# EAGLE design SingleMotorBoard (EAGLE 8.5.0)
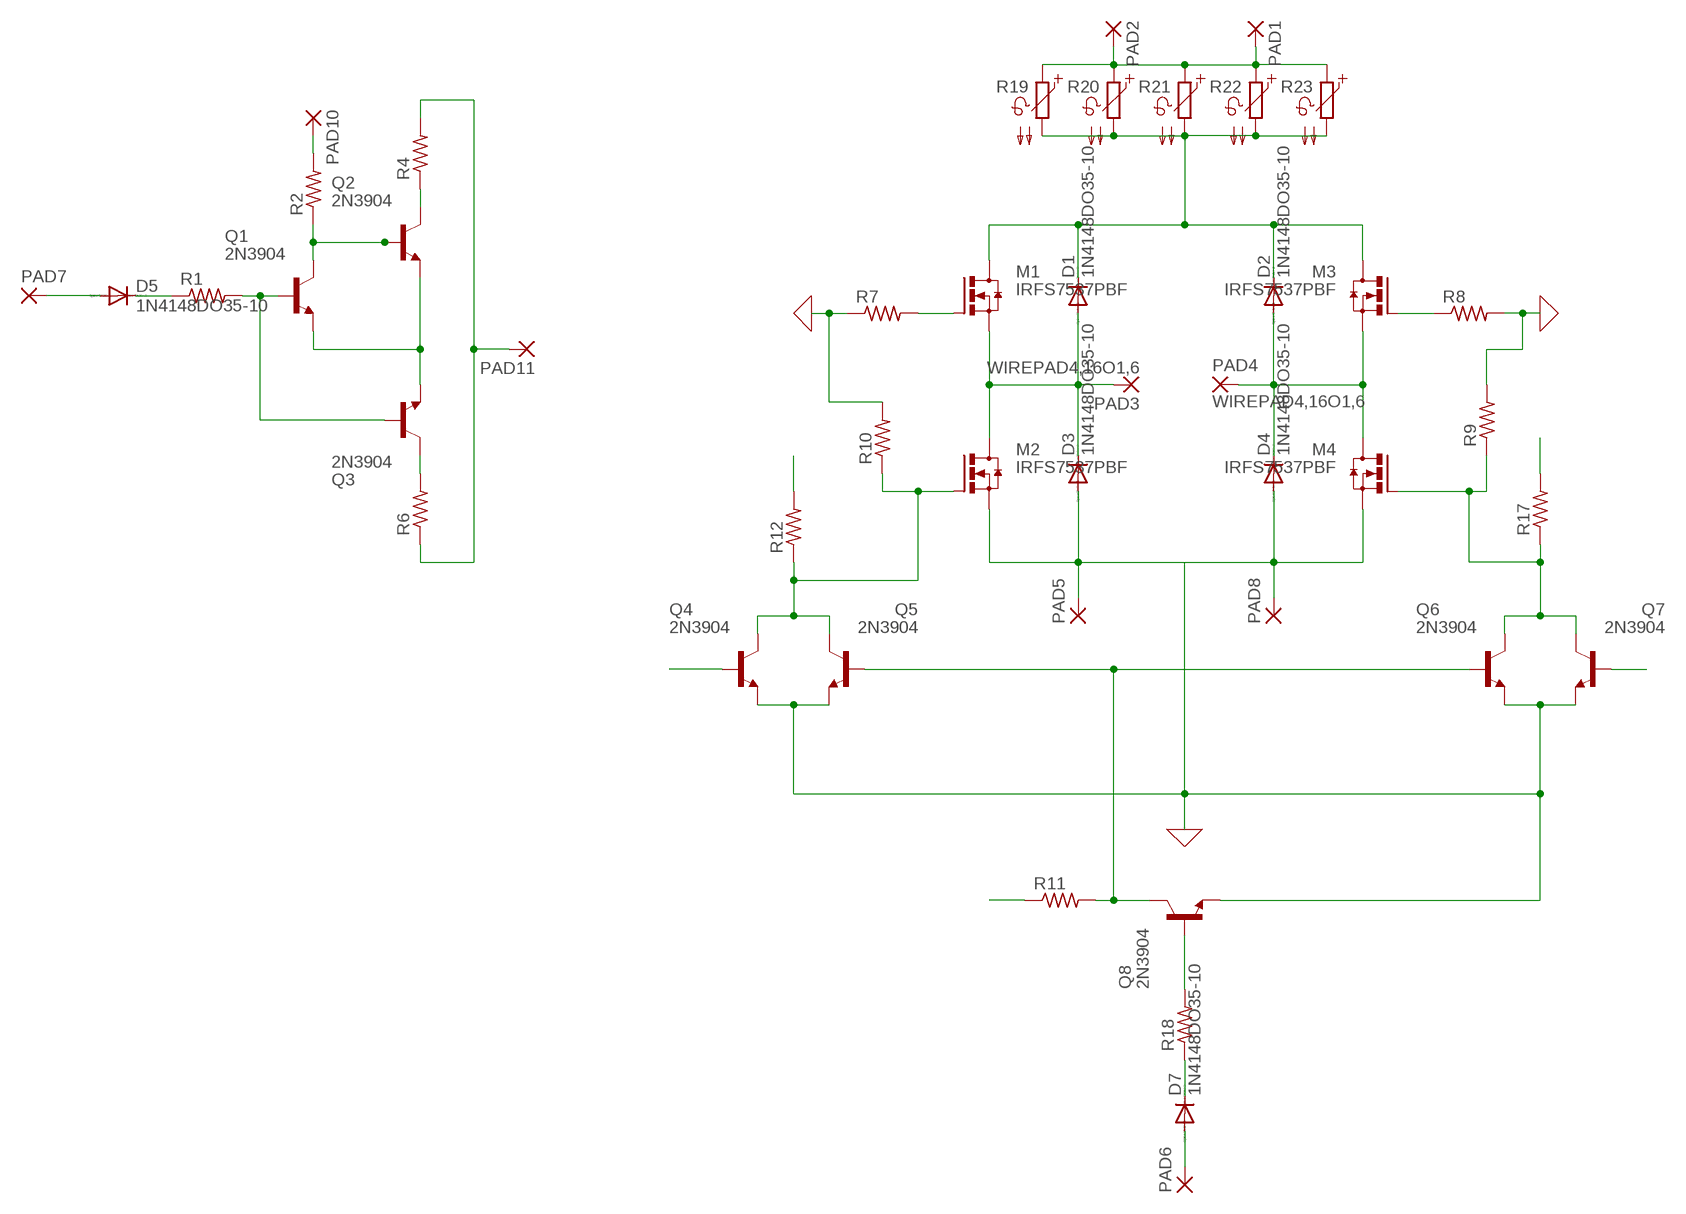
[diagram p0: schematic, sheet 1]

## Parts
D1  1N4148DO35-10  [DO35-10]
D2  1N4148DO35-10  [DO35-10]
D3  1N4148DO35-10  [DO35-10]
D4  1N4148DO35-10  [DO35-10]
D5  1N4148DO35-10  [DO35-10]
D7  1N4148DO35-10  [DO35-10]
M1  IRFS7537PBF  [D2PACK]
M2  IRFS7537PBF  [D2PACK]
M3  IRFS7537PBF  [D2PACK]
M4  IRFS7537PBF  [D2PACK]
PAD1  3,81/1,4  [3,81/1,4]
PAD2  3,81/1,4  [3,81/1,4]
PAD3  WIREPAD4,16O1,6  [4,16O1,6]
PAD4  WIREPAD4,16O1,6  [4,16O1,6]
PAD5  3,81/1,4  [3,81/1,4]
PAD6  2,54/1,1  [2,54/1,1]
PAD7  2,54/1,0  [2,54/1,0]
PAD8  3,81/1,4  [3,81/1,4]
PAD10  2,54/1,1  [2,54/1,1]
PAD11  2,54/1,1  [2,54/1,1]
Q1  2N3904  [TO92]
Q2  2N3904  [TO92]
Q3  2N3904  [TO92]
Q4  2N3904  [TO92]
Q5  2N3904  [TO92]
Q6  2N3904  [TO92]
Q7  2N3904  [TO92]
Q8  2N3904  [TO92]
R1  R-US_0207/7  [0207/7]
R2  R-US_0207/7  [0207/7]
R4  R-US_0207/7  [0207/7]
R6  R-US_0207/7  [0207/7]
R7  R-US_0207/7  [0207/7]
R8  R-US_0207/7  [0207/7]
R9  R-US_0207/7  [0207/7]
R10  R-US_0207/7  [0207/7]
R11  R-US_0207/7  [0207/7]
R12  R-US_0207/7  [0207/7]
R17  R-US_0207/7  [0207/7]
R18  R-US_0207/7  [0207/7]
R19  PTC660A  [P660A]
R20  PTC660A  [P660A]
R21  PTC660A  [P660A]
R22  PTC660A  [P660A]
R23  PTC660A  [P660A]

## Nets
0: D3.A D4.A M2.3(S) M4.3(S) PAD5.1(P) PAD8.1(P) Q1.3(E) Q2.3(E) Q3.3(E) Q4.3(E) Q5.3(E) Q6.3(E) Q7.3(E) Q8.3(E) R7.1 R8.2 R9.2 R10.2 ; supply symbol labelled GND
BB: Q1.2(B) Q3.2(B) Q4.2(B) R1.2
BF: M3.1(G) Q3.1(C) R6.2 R8.1
DIR: D5.A PAD7.1(P)
FB: Q1.1(C) Q2.2(B) Q7.2(B) R2.1
FF: M1.1(G) Q2.1(C) R4.1 R7.2
MN: D2.A D4.C M3.3(S) M4.2(D) PAD4.1(P)
MP: D1.A D3.C M1.3(S) M2.2(D) PAD3.1(P)
N$2: D7.C R18.1
N$4: D7.A PAD6.1(P)
N$16: Q5.2(B) Q6.2(B) Q8.1(C) R11.2
N$19: D5.C R1.1
N$20: M2.1(G) Q4.1(C) Q5.1(C) R10.1 R12.1
N$23: Q8.2(B) R18.2
N$27: M4.1(G) Q6.1(C) Q7.1(C) R9.1 R17.1
VBAT: PAD1.1(P) PAD2.1(P) R19.1 R20.1 R21.1 R22.1 R23.1
VDD: D1.C D2.C M1.2(D) M3.2(D) R19.2 R20.2 R21.2 R22.2 R23.2
VG: PAD11.1(P) R4.2 R6.1 R12.2 R17.2
VSW: PAD10.1(P) R2.2 R11.1

## Library data of the parts
D1-D5 D7 = diode:1N4148: DIODE high speed (Philips)
M1-M4 = EagleCAD:IRFS7537PBF: IRFS7537PBF Infineon International Rectifier DATASHEET: http://www.infineon.com/dgdl/irfs7537pbf.pdf?fileId=5546d462533600a4015364c3ee2729cb
PAD1 PAD2 PAD5 PAD8 = wirepad:3,81/1,4: THROUGH-HOLE PAD
PAD3 PAD4 = wirepad:WIREPAD: Wire PAD connect wire on PCB
PAD6 PAD10 PAD11 = wirepad:2,54/1,1: THROUGH-HOLE PAD
PAD7 = wirepad:2,54/1,0: THROUGH-HOLE PAD
Q1-Q8 = transistor-npn:2N3904: NPN Transistor
R1 R2 R4 R6-R12 R18 = rcl:R-US_: RESISTOR, American symbol; SPICEPREFIX: R
R17 = resistor:R-US_: RESISTOR, American symbol
R19-R23 = ptc-ntc:PTC660A: PHILIPS PTC; OC_FARNELL: unknown; OC_NEWARK: unknown

## Board
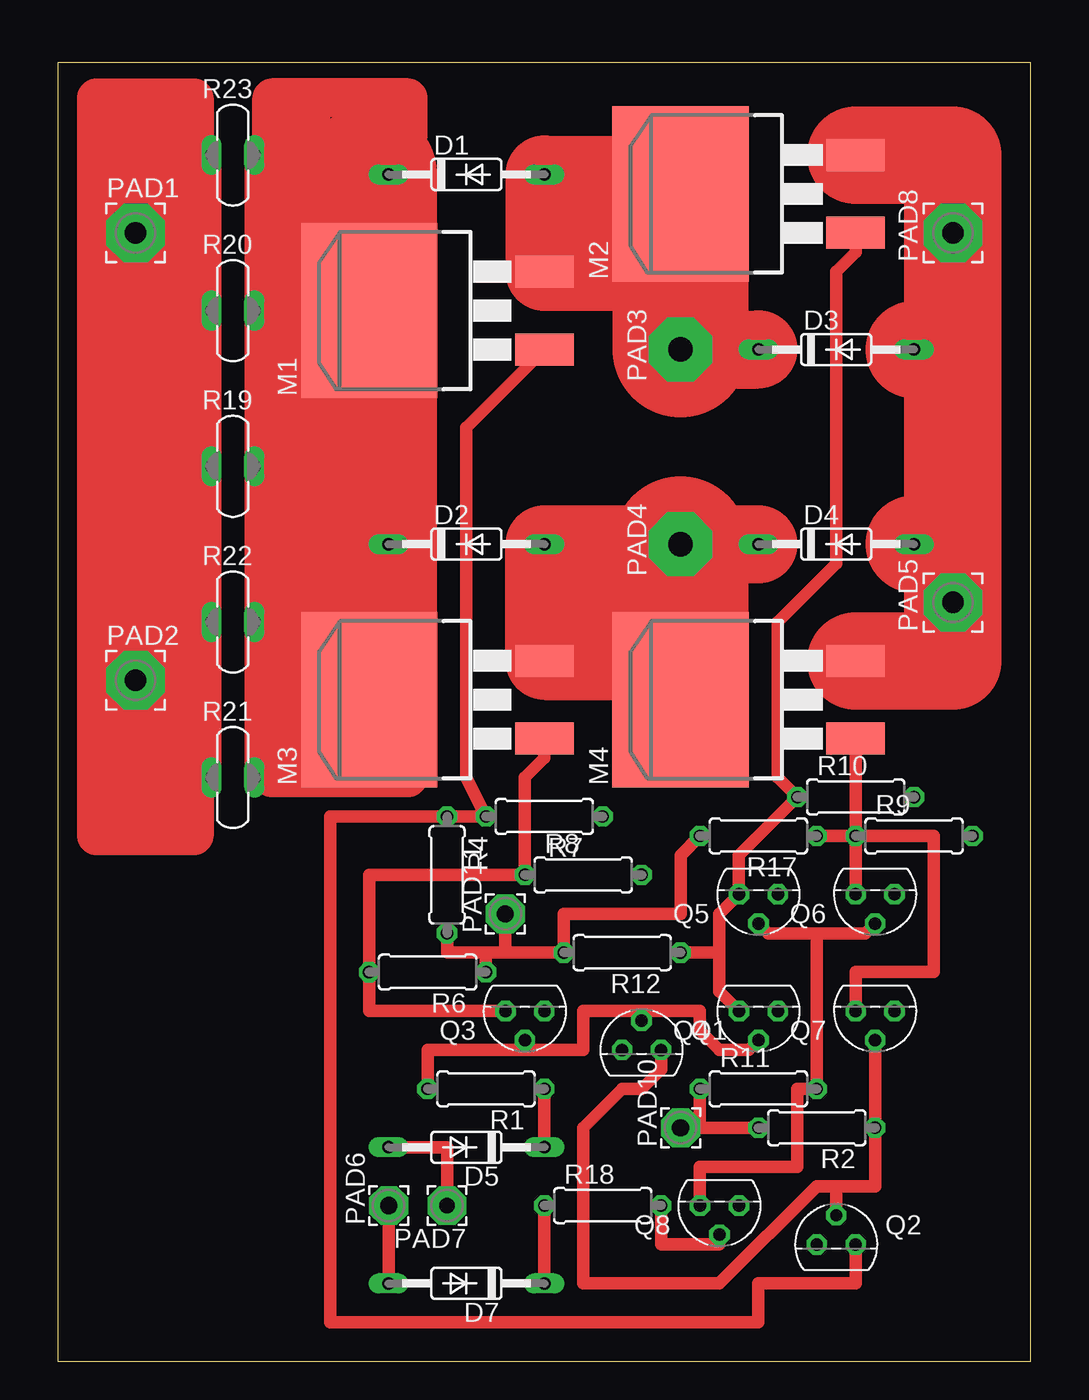
[diagram p1: board, top side]
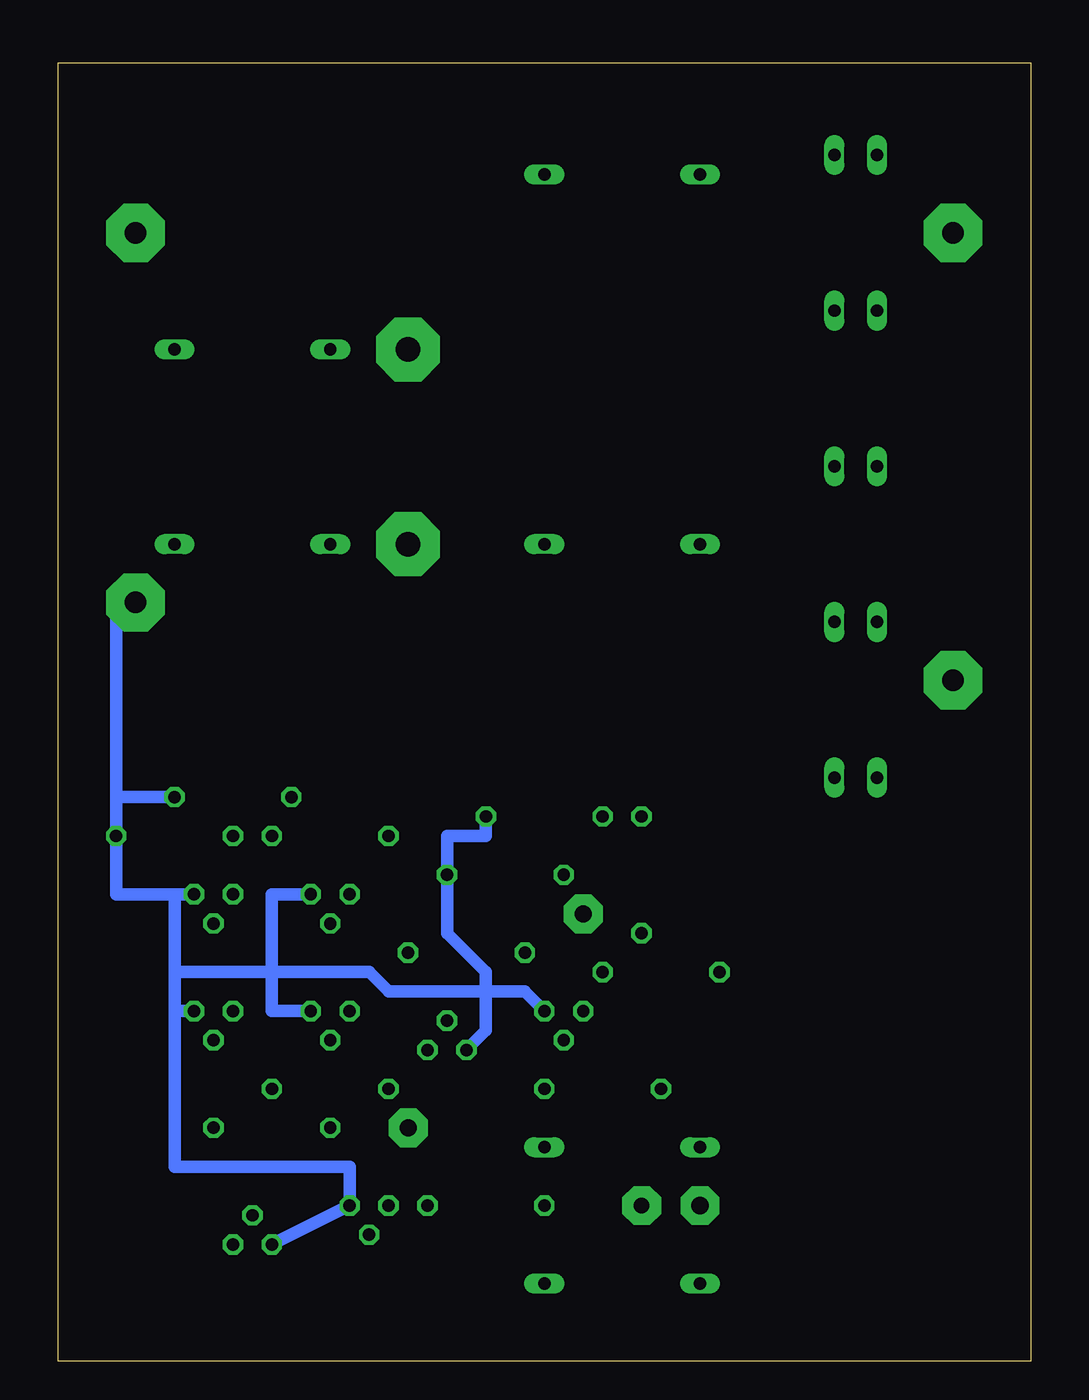
[diagram p2: board, bottom side, seen from below]

Size 63.48 x 84.76 mm. Coordinates in mm from the lower left corner, seen from the top.
Outline: 0,0 63.48,0 63.48,84.76 0,84.76 0,0
Copper layers (1*16): Top 0.035mm / dielectric 1.5mm / Bottom 0.035mm
Design rules "default": minimum track width 6mil, minimum drill 0.35mm, track to track 6mil, track to pad 6mil, pad to pad 6mil, via to via 6mil, smd to smd 6mil, copper to edge 40mil, drill to drill 6mil, minimum pad ring 10mil, minimum via ring 8mil, stop-mask expansion 4mil, vias tented up to drill 0mil, thermal gap 10mil

### Footprints (pad centres in the part's own frame; a part is rotated, then mirrored left to right if it is on the bottom)
DO35-10 = drill 0.813 long: A 5.08,0; C -5.08,0
D2PACK = smd 2.083 x 3.81: 1 -2.54,-8.89; 3 2.54,-8.89 | smd 11.43 x 8.89: 2 0,2.54
3,81/1,4 = drill 1.397 pad 3.81 octagon: 1 0,0
4,16O1,6 = drill 1.6 pad 4.166 octagon: 1 0,0
2,54/1,1 = drill 1.118 pad 2.54 octagon: 1 0,0
2,54/1,0 = drill 1.016 pad 2.54 octagon: 1 0,0
TO92 = drill 0.813 octagon: 1 1.27,0; 2 0,1.905; 3 -1.27,0
0207/7 = drill 0.813 octagon: 1 -3.81,0; 2 3.81,0
P660A = drill 0.813 long: 1 -1.397,0; 2 1.397,0

### Placement (x,y rotation side)
D1  26.67,77.47 0 top
D2  26.67,53.34 0 top
D3  50.8,66.04 0 top
D4  50.8,53.34 0 top
D5  26.67,13.97 180 top
D7  26.67,5.08 180 top
M1  22.86,68.58 90 top
M2  43.18,76.2 90 top
M3  22.86,43.18 90 top
M4  43.18,43.18 90 top
PAD1  5.08,73.66 0 top
PAD2  5.08,44.45 0 top
PAD3  40.64,66.04 90 top
PAD4  40.64,53.34 90 top
PAD5  58.42,49.53 90 top
PAD6  21.59,10.16 90 top
PAD7  25.4,10.16 180 top
PAD8  58.42,73.66 90 top
PAD10  40.64,15.24 90 top
PAD11  29.21,29.21 90 top
Q1  38.1,20.32 0 top
Q2  50.8,7.62 0 top
Q3  30.48,22.86 180 top
Q4  45.72,22.86 180 top
Q5  45.72,30.48 180 top
Q6  53.34,30.48 180 top
Q7  53.34,22.86 180 top
Q8  43.18,10.16 180 top
R1  27.94,17.78 180 top
R2  49.53,15.24 180 top
R4  25.4,31.75 270 top
R6  24.13,25.4 180 top
R7  31.75,35.56 180 top
R8  34.29,31.75 0 top
R9  55.88,34.29 0 top
R10  52.07,36.83 0 top
R11  45.72,17.78 0 top
R12  36.83,26.67 180 top
R17  45.72,34.29 180 top
R18  35.56,10.16 0 top
R19  11.43,58.42 0 top
R20  11.43,68.58 0 top
R21  11.43,38.1 0 top
R22  11.43,48.26 0 top
R23  11.43,78.74 0 top

### Tracks (layer width: path | path; a pad name or v marks a point on that pad's centre or on a via)
0
  Top 0.152: PAD5.1 58.42,53.34 | PAD8.1 58.42,78.74
  Top 6.35: 58.42,66.04 58.42,78.74 M2.3 | 58.42,66.04 58.42,53.34 | 58.42,53.34 58.42,45.72 M4.3 | D4.A 58.42,53.34 | D3.A 58.42,66.04
  Bottom 0.813: Q7.3 55.88,22.86 | 55.88,22.86 55.88,25.4 | 55.88,25.4 55.88,30.48 | 55.88,30.48 Q6.3 | R9.2 59.69,30.48 55.88,30.48 | R9.2 | R9.2 59.69,36.83 | 35.56,34.29 38.1,34.29 R8.2 38.1,27.94 35.56,25.4 35.56,24.13 | 35.56,34.29 | Q4.3 49.53,22.86 49.53,25.4 | 49.53,25.4 49.53,30.48 Q5.3 | 49.53,25.4 55.88,25.4 | Q3.3 33.02,24.13 35.56,24.13 | 35.56,24.13 35.56,21.59 Q1.3 | R7.1 | R7.1 35.56,34.29 | R10.2 59.69,36.83 | Q2.3 Q8.3 44.45,12.7 55.88,12.7 55.88,22.86 | 59.69,36.83 59.69,49.53 PAD5.1 | 35.56,24.13 41.91,24.13 43.18,25.4 49.53,25.4
BB
  Top 0.813: Q4.2 45.09,20.32 43.18,20.32 41.91,21.59 41.91,22.86 38.1,22.86 | 30.48,20.32 24.13,20.32 R1.2 | 30.48,20.32 34.29,20.32 34.29,22.86 38.1,22.86 | Q3.2 30.48,20.32 | Q1.2 38.1,22.86
BF
  Top 0.813: Q3.1 20.32,22.86 R6.2 20.32,31.75 R8.1 30.48,38.1 31.75,39.37 M3.1
DIR
  Top 0.813: D5.A 25.4,13.97 PAD7.1
FB
  Top 0.813: Q7.2 R2.1 53.34,11.43 50.8,11.43 | 50.8,11.43 49.53,11.43 43.18,5.08 34.29,5.08 34.29,15.24 36.83,17.78 38.1,17.78 39.37,19.05 Q1.1 | Q2.2 50.8,11.43
FF
  Top 0.813: M1.1 26.67,60.96 26.67,38.1 R7.2 | R7.2 | R7.2 R4.1 17.78,35.56 17.78,2.54 45.72,2.54 45.72,5.08 52.07,5.08 Q2.1
MN
  Top 5.08: PAD4.1 D2.A 31.75,49.53 | M4.2 38.1,45.72 M3.3 31.75,49.53 | PAD4.1 D4.C | 31.75,49.53 39.37,49.53 40.64,50.8 PAD4.1
  Top 8.89: M4.2 PAD4.1
MP
  Top 5.08: M2.2 40.64,78.74 39.37,77.47 D1.A M1.3 | M1.3 40.64,71.12 | D3.C PAD3.1 40.64,72.39 39.37,73.66 34.29,73.66 M1.3
  Top 8.89: PAD3.1 40.64,71.12 M2.2
N$2
  Top 0.813: R18.1 D7.C
N$4
  Top 0.813: PAD6.1 D7.A
N$16
  Top 0.813: Q5.2 46.35,27.94 49.53,27.94 | Q6.2 52.7,27.94 49.53,27.94 | 49.53,27.94 R11.2 48.26,17.78 48.26,12.7 41.91,12.7 Q8.1
N$19
  Top 0.813: R1.1 D5.C
N$20
  Top 0.813: Q4.1 43.18,24.13 43.18,26.67 | 43.18,26.67 43.18,29.21 Q5.1 44.45,33.02 R10.1 46.99,38.1 46.99,48.26 50.8,52.07 50.8,71.12 52.07,72.39 M2.1 | R12.1 43.18,26.67
N$23
  Top 0.813: R18.2 39.37,7.62 43.18,7.62 Q8.2
N$27
  Top 0.813: Q6.1 R9.1 | R9.1 M4.1 | Q7.1 52.07,25.4 57.15,25.4 57.15,34.29 R9.1 | R17.1 R9.1
VBAT
  Top 1.27: R19.1 R20.1 | R22.1 R19.1 | R22.1 R21.1 8.89,38.1 5.08,38.1 | R20.1 R23.1 8.89,78.74 6.35,78.74 5.08,80.01 | R20.1 8.89,68.58 5.08,68.58 | R19.1 8.89,58.42 5.08,58.42 | R22.1 8.89,48.26 5.08,48.26
  Top 2.54: 8.89,35.56 8.89,38.1 8.89,48.26 8.89,58.42 8.89,68.58 8.89,78.74 8.89,82.47 2.54,82.47 2.54,34.29 8.89,34.29 8.89,35.56 | 5.08,38.1 7.62,35.56 8.89,35.56
  Top 6.35: 5.08,38.1 PAD2.1 5.08,48.26 5.08,58.42 5.08,68.58 PAD1.1 5.08,80.01
VDD
  Top 1.27: R20.2 R23.2 13.97,78.74 15.24,78.74 16.51,78.74 20.32,78.74 D1.C | R19.2 R20.2 | R19.2 R22.2 | R22.2 R21.2 13.97,38.1 | 15.24,38.1 20.32,38.1 M3.2 | R22.2 13.97,48.26 15.24,48.26 19.05,48.26 20.32,49.53 | R19.2 13.97,58.42 15.24,58.42 20.32,58.42 | R20.2 13.97,68.58 15.24,68.58 21.59,68.58
  Top 2.54: 21.59,58.42 D2.C | 16.51,82.47 22.86,82.47 22.86,80.01 20.32,77.47 | 16.51,82.47 15.24,82.47 | 15.24,82.47 13.97,82.47 13.97,78.74 13.97,68.58 13.97,58.42 13.97,48.26 13.97,38.1 15.24,38.1 | 15.24,82.47 15.24,78.74 15.24,68.58 15.24,58.42 15.24,48.26 15.24,38.1 | 16.51,82.47 16.51,78.74 | 15.24,38.1 22.86,38.1
  Top 5.08: D2.C 20.32,52.07 20.32,49.53 | D1.C 21.59,68.58 M1.2
  Top 8.89: M3.2 20.32,49.53 20.32,58.42 M1.2 20.32,77.47
VG
  Top 0.813: R6.1 27.94,26.67 | 27.94,26.67 29.21,26.67 | 29.21,26.67 R12.2 33.02,29.21 40.64,29.21 40.64,33.02 R17.2 | R4.2 25.4,26.67 27.94,26.67 | PAD11.1 29.21,26.67
VSW
  Top 0.813: PAD10.1 41.91,15.24 | 41.91,15.24 R2.2 | R11.1 41.91,15.24